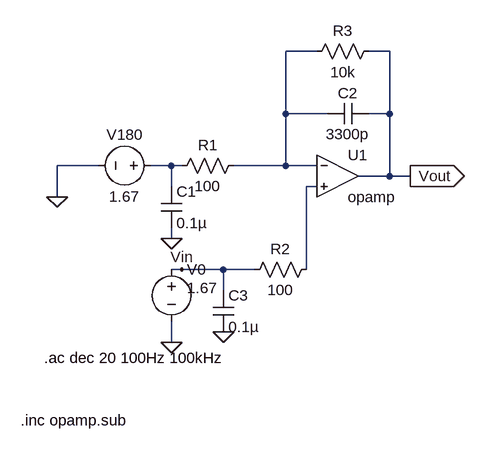
[diagram p0: schematic tayloe_amp_subcircuit.asc]
tayloe_amp_subcircuit.asc, the LTspice schematic file:
Version 4
SHEET 1 880 680
WIRE 288 -32 240 -32
WIRE 400 -32 368 -32
WIRE 240 64 240 -32
WIRE 304 64 240 64
WIRE 400 64 400 -32
WIRE 400 64 368 64
WIRE -48 144 -112 144
WIRE 64 144 32 144
WIRE 80 144 64 144
WIRE 240 144 240 64
WIRE 240 144 160 144
WIRE 288 144 240 144
WIRE 400 160 400 64
WIRE 400 160 352 160
WIRE 432 160 400 160
WIRE 64 176 64 144
WIRE 288 176 272 176
WIRE -112 192 -112 144
WIRE 64 256 64 240
WIRE 80 304 64 304
WIRE 144 304 80 304
WIRE 192 304 144 304
WIRE 272 304 272 176
WIRE 144 336 144 304
WIRE 64 416 64 384
FLAG -112 192 0
FLAG 64 416 0
FLAG 64 256 0
FLAG 144 400 0
FLAG 432 160 Vout
IOPIN 432 160 Out
FLAG 80 304 Vin
SYMBOL Opamps\\opamp 320 96 R0
SYMATTR InstName U1
SYMBOL voltage 48 144 R90
WINDOW 0 -32 56 VBottom 2
WINDOW 3 32 56 VTop 2
SYMATTR InstName V180
SYMATTR Value 1.67
SYMBOL res 176 128 R90
WINDOW 0 0 56 VBottom 2
WINDOW 3 32 56 VTop 2
SYMATTR InstName R1
SYMATTR Value 100
SYMBOL cap 48 176 R0
SYMATTR InstName C1
SYMATTR Value 0.1µ
SYMATTR SpiceLine Rser=0.01
SYMBOL cap 368 48 R90
WINDOW 0 0 32 VBottom 2
WINDOW 3 32 32 VTop 2
SYMATTR InstName C2
SYMATTR Value 3300p
SYMBOL voltage 64 288 R0
WINDOW 3 24 44 Left 2
WINDOW 39 0 0 Left 0
SYMATTR InstName V0
SYMATTR Value 1.67
SYMATTR Value2 AC 1 0
SYMBOL res 288 288 R90
WINDOW 0 0 56 VBottom 2
WINDOW 3 32 56 VTop 2
SYMATTR InstName R2
SYMATTR Value 100
SYMBOL res 384 -48 R90
WINDOW 0 0 56 VBottom 2
WINDOW 3 32 56 VTop 2
SYMATTR InstName R3
SYMATTR Value 10k
SYMBOL cap 128 336 R0
SYMATTR InstName C3
SYMATTR Value 0.1µ
SYMATTR SpiceLine Rser=0.01
TEXT -132 440 Left 2 !.ac dec 20 100Hz 100kHz
TEXT -168 536 Left 2 !.inc opamp.sub

The netlist it stands for:
* tayloe_amp_subcircuit.asc
XU1 N001 N003 Vout opamp Aol=100K GBW=10Meg  ; pins invin noninvin out
V180 N002 0 1.67
R1 N001 N002 100
C1 N002 0 0.1µ Rser=0.01
C2 Vout N001 3300p
V0 Vin 0 1.67 AC 1 0
R2 N003 Vin 100
R3 Vout N001 10k
C3 Vin 0 0.1µ Rser=0.01
.ac dec 20 100Hz 100kHz
.inc opamp.sub
.backanno
.end